# Altium schematic sheet RFFE-Pilot-Ver1.SchDoc
size A2; SheetNumber: 2; SheetTotal: 3
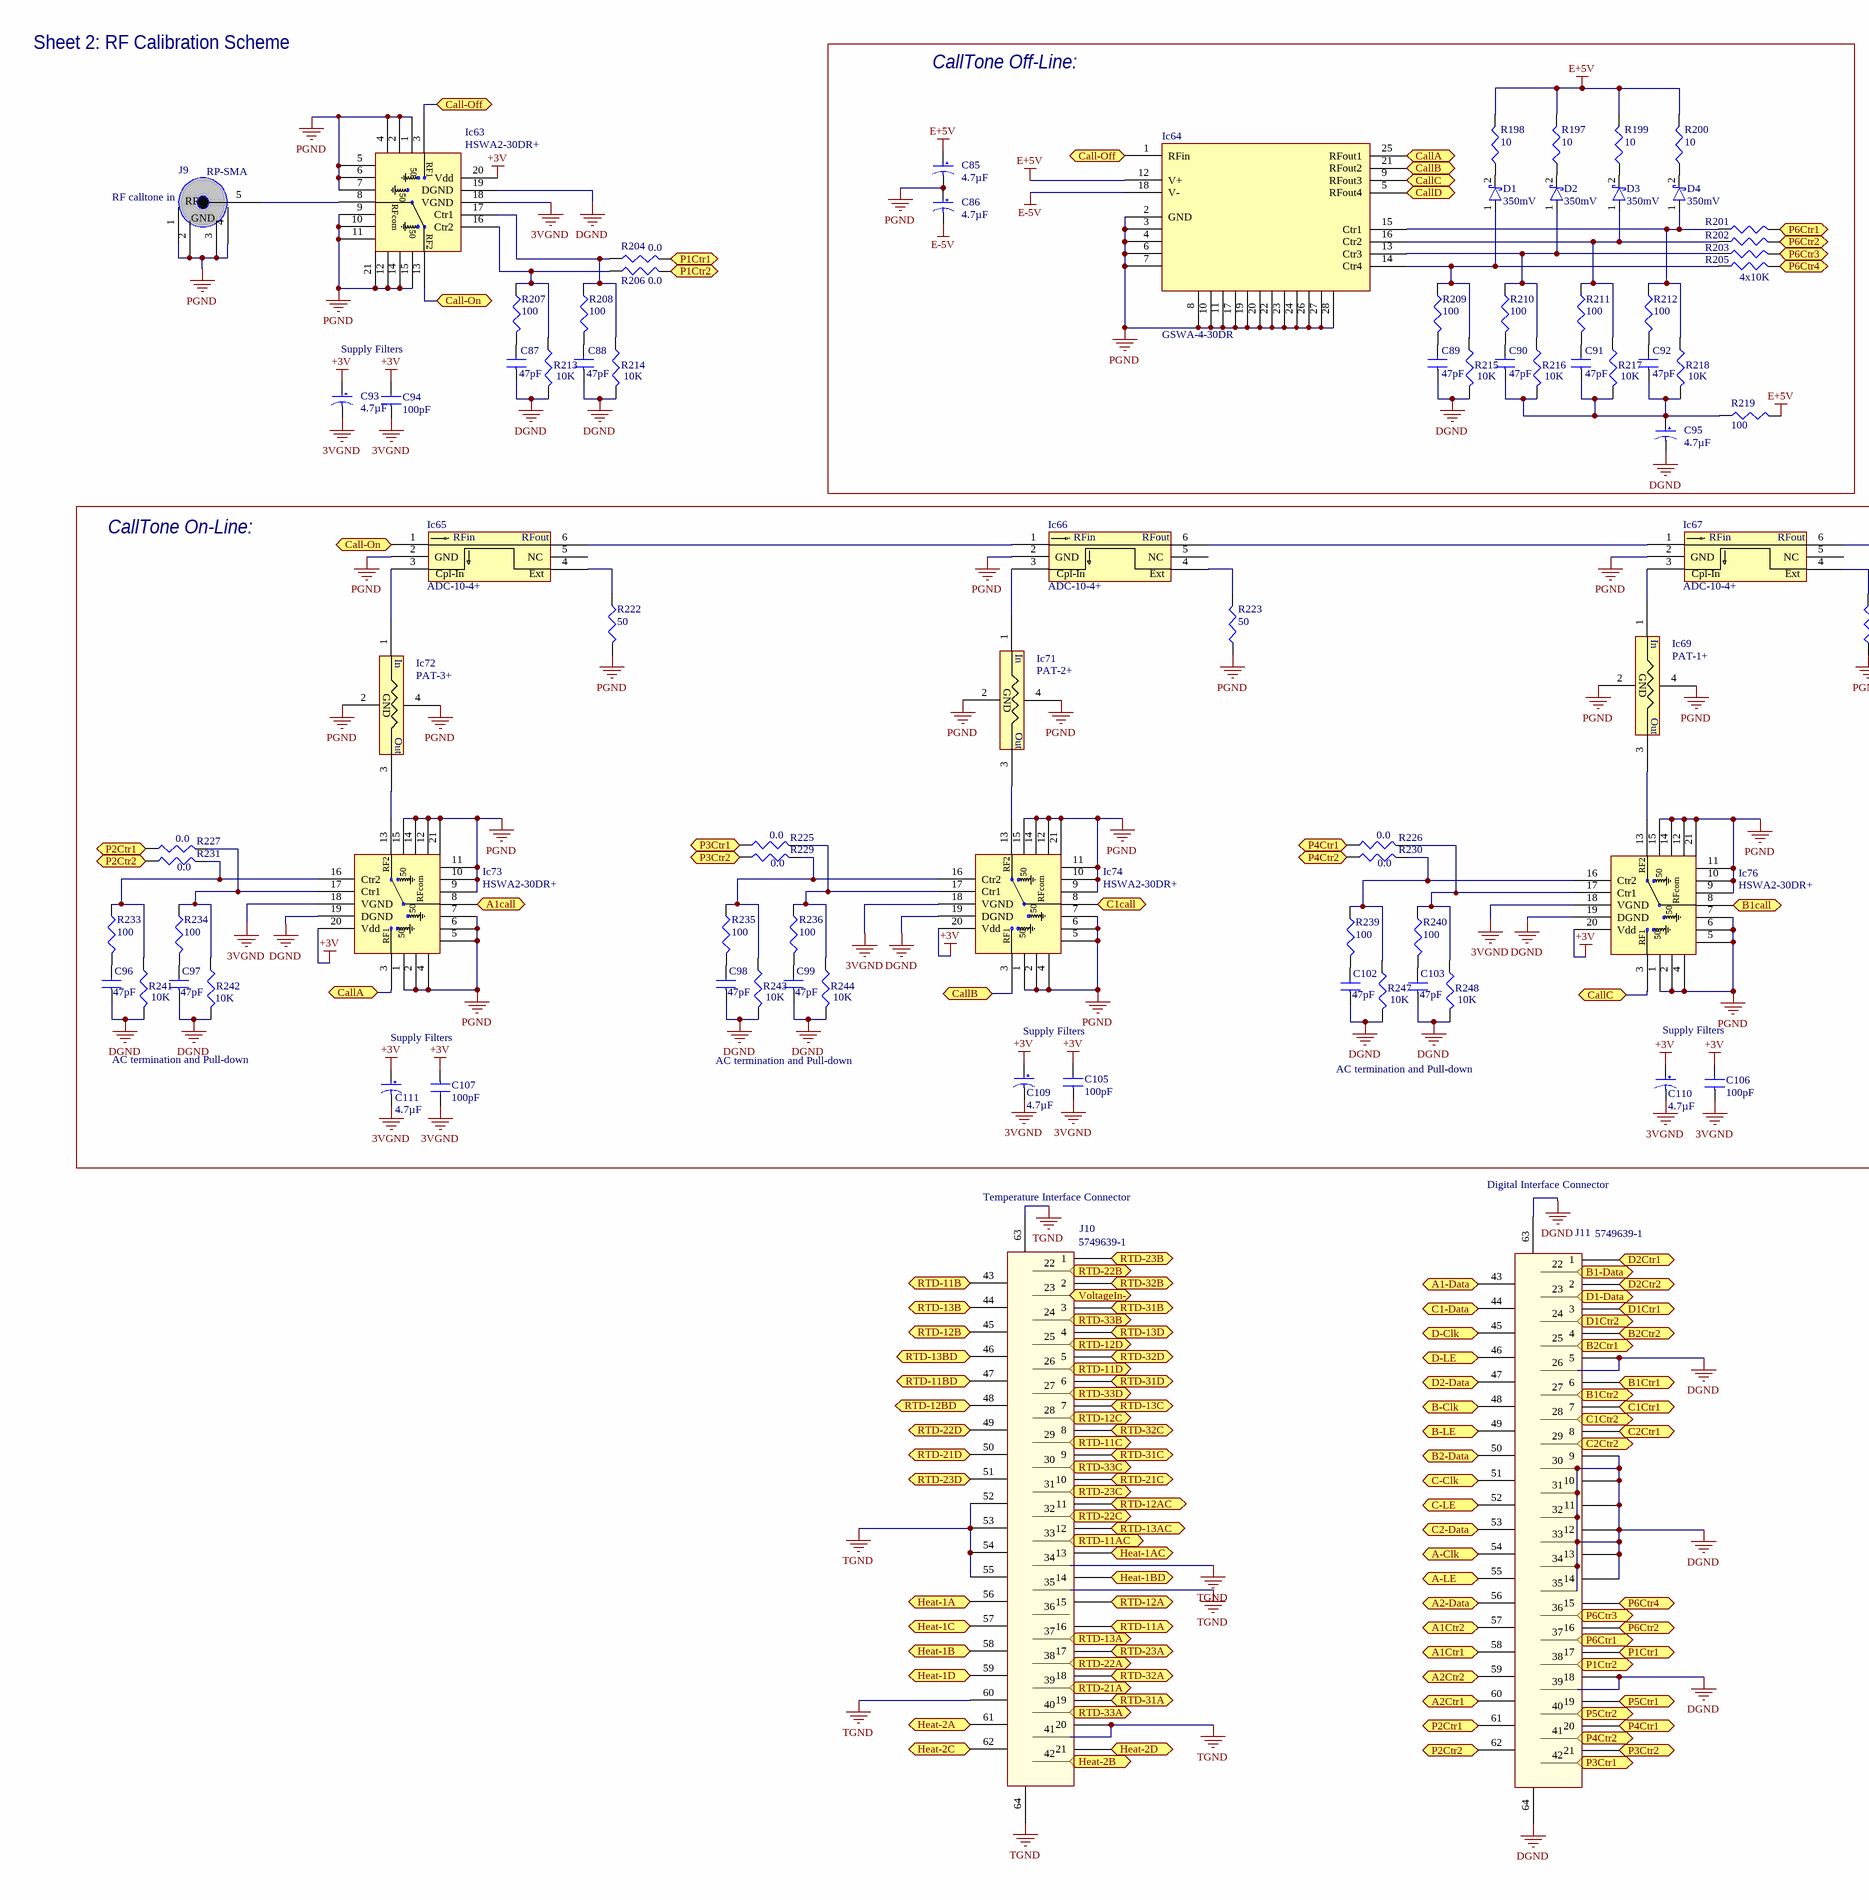
[diagram p0: RFFE-Pilot-Ver1.SchDoc, left]
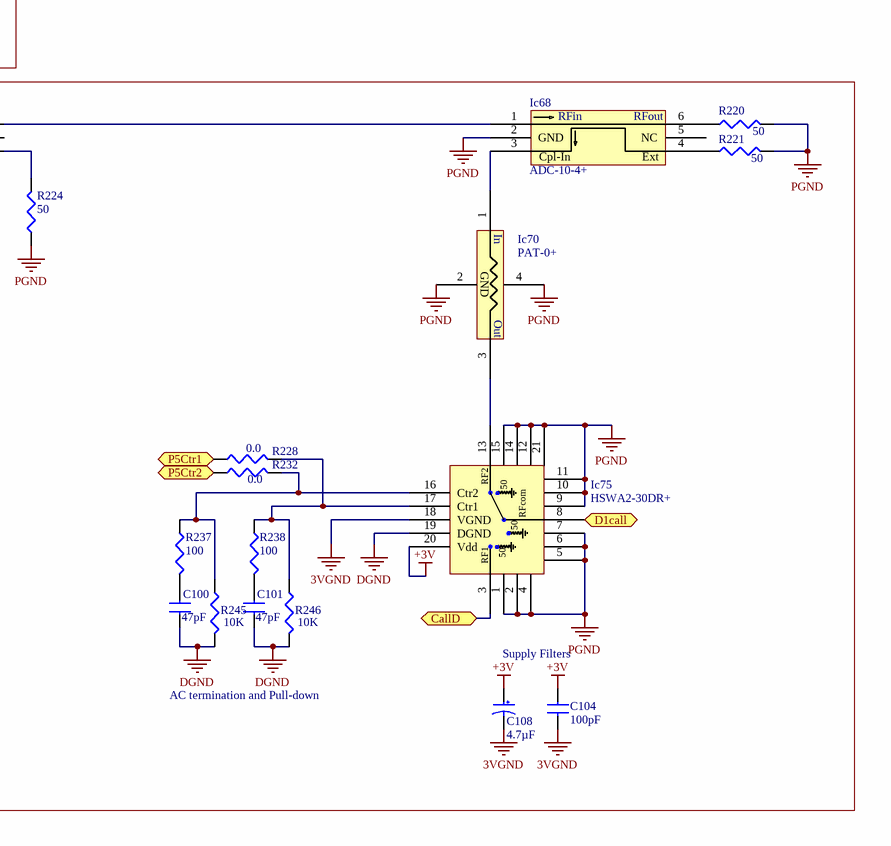
[diagram p1: RFFE-Pilot-Ver1.SchDoc, right]

## Parts
C85  Capacitance: 4.7µF  [TC3528-1411]  (hidden comment: CAP TANT 4.7UF)
C86  Capacitance: 4.7µF  [TC3528-1411]  (hidden comment: CAP TANT 4.7UF)
C87  Capacitance: 47pF  [CAPC1608N]  (hidden comment: C1608C0G1H470J)
C88  Capacitance: 47pF  [CAPC1608N]  (hidden comment: C1608C0G1H470J)
C89  Capacitance: 47pF  [CAPC1608N]  (hidden comment: C1608C0G1H470J)
C90  Capacitance: 47pF  [CAPC1608N]  (hidden comment: C1608C0G1H470J)
C91  Capacitance: 47pF  [CAPC1608N]  (hidden comment: C1608C0G1H470J)
C92  Capacitance: 47pF  [CAPC1608N]  (hidden comment: C1608C0G1H470J)
C93  Capacitance: 4.7µF  [TC3528-1411]  (hidden comment: CAP TANT 4.7UF)
C94  Capacitance: 100pF  [CAPC1608N]  (hidden comment: C1608C0G1H101J)
C95  Capacitance: 4.7µF  [TC3528-1411]  (hidden comment: CAP TANT 4.7UF)
C96  Capacitance: 47pF  [CAPC1608N]  (hidden comment: C1608C0G1H470J)
C97  Capacitance: 47pF  [CAPC1608N]  (hidden comment: C1608C0G1H470J)
C98  Capacitance: 47pF  [CAPC1608N]  (hidden comment: C1608C0G1H470J)
C99  Capacitance: 47pF  [CAPC1608N]  (hidden comment: C1608C0G1H470J)
C100  Capacitance: 47pF  [CAPC1608N]  (hidden comment: C1608C0G1H470J)
C101  Capacitance: 47pF  [CAPC1608N]  (hidden comment: C1608C0G1H470J)
C102  Capacitance: 47pF  [CAPC1608N]  (hidden comment: C1608C0G1H470J)
C103  Capacitance: 47pF  [CAPC1608N]  (hidden comment: C1608C0G1H470J)
C104  Capacitance: 100pF  [CAPC1608N]  (hidden comment: C1608C0G1H101J)
C105  Capacitance: 100pF  [CAPC1608N]  (hidden comment: C1608C0G1H101J)
C106  Capacitance: 100pF  [CAPC1608N]  (hidden comment: C1608C0G1H101J)
C107  Capacitance: 100pF  [CAPC1608N]  (hidden comment: C1608C0G1H101J)
C108  Capacitance: 4.7µF  [TC3528-1411]  (hidden comment: CAP TANT 4.7UF)
C109  Capacitance: 4.7µF  [TC3528-1411]  (hidden comment: CAP TANT 4.7UF)
C110  Capacitance: 4.7µF  [TC3528-1411]  (hidden comment: CAP TANT 4.7UF)
C111  Capacitance: 4.7µF  [TC3528-1411]  (hidden comment: CAP TANT 4.7UF)
D1  Voltage - Forward (Vf) (Max) @ If: 350mV  [RESC1005L]  (hidden comment: RB521CS-30T2R)
D2  Voltage - Forward (Vf) (Max) @ If: 350mV  [RESC1005L]  (hidden comment: RB521CS-30T2R)
D3  Voltage - Forward (Vf) (Max) @ If: 350mV  [RESC1005L]  (hidden comment: RB521CS-30T2R)
D4  Voltage - Forward (Vf) (Max) @ If: 350mV  [RESC1005L]  (hidden comment: RB521CS-30T2R)
Ic63  HSWA2-30DR+  [DG983-1]
Ic64  GSWA-4-30DR  [AN1102]
Ic65  ADC-10-4+  [CD542]
Ic66  ADC-10-4+  [CD542]
Ic67  ADC-10-4+  [CD542]
Ic68  ADC-10-4+  [CD542]
Ic69  PAT-1+  [AF320]
Ic70  PAT-0+  [AF320]
Ic71  PAT-2+  [AF320]
Ic72  PAT-3+  [AF320]
Ic73  HSWA2-30DR+  [DG983-1]
Ic74  HSWA2-30DR+  [DG983-1]
Ic75  HSWA2-30DR+  [DG983-1]
Ic76  HSWA2-30DR+  [DG983-1]
J9  Connector Style: RP-SMA  [SMAedge50R]  (hidden comment: CONN SMA)
J10  CONN D-SUB  [D-SUB62]  (value not drawn)
J11  CONN D-SUB  [D-SUB62]  (value not drawn)
R197  Resistance (Ohms): 10  [RESC1608N]  (hidden comment: ERJ-3GEYJ100V)
R198  Resistance (Ohms): 10  [RESC1608N]  (hidden comment: ERJ-3GEYJ100V)
R199  Resistance (Ohms): 10  [RESC1608N]  (hidden comment: ERJ-3GEYJ100V)
R200  Resistance (Ohms): 10  [RESC1608N]  (hidden comment: ERJ-3GEYJ100V)
R201  ERJ-3GEYJ103V  [RESC1608N]  (value not drawn)
R202  ERJ-3GEYJ103V  [RESC1608N]  (value not drawn)
R203  ERJ-3GEYJ103V  [RESC1608N]  (value not drawn)
R204  Resistance (Ohms): 0.0  [CAPC1608N]  (hidden comment: ERJ-3GEY0R00V)
R205  Resistance (Ohms): 10K  [RESC1608N]  (hidden comment: ERJ-3GEYJ103V)
R206  Resistance (Ohms): 0.0  [CAPC1608N]  (hidden comment: ERJ-3GEY0R00V)
R207  Resistance (Ohms): 100  [RESC1608N]  (hidden comment: ERJ-3GEYJ101V)
R208  Resistance (Ohms): 100  [RESC1608N]  (hidden comment: ERJ-3GEYJ101V)
R209  Resistance (Ohms): 100  [RESC1608N]  (hidden comment: ERJ-3GEYJ101V)
R210  Resistance (Ohms): 100  [RESC1608N]  (hidden comment: ERJ-3GEYJ101V)
R211  Resistance (Ohms): 100  [RESC1608N]  (hidden comment: ERJ-3GEYJ101V)
R212  Resistance (Ohms): 100  [RESC1608N]  (hidden comment: ERJ-3GEYJ101V)
R213  Resistance (Ohms): 10K  [RESC1608N]  (hidden comment: ERJ-3GEYJ103V)
R214  Resistance (Ohms): 10K  [RESC1608N]  (hidden comment: ERJ-3GEYJ103V)
R215  Resistance (Ohms): 10K  [RESC1608N]  (hidden comment: ERJ-3GEYJ103V)
R216  Resistance (Ohms): 10K  [RESC1608N]  (hidden comment: ERJ-3GEYJ103V)
R217  Resistance (Ohms): 10K  [RESC1608N]  (hidden comment: ERJ-3GEYJ103V)
R218  Resistance (Ohms): 10K  [RESC1608N]  (hidden comment: ERJ-3GEYJ103V)
R219  Resistance (Ohms): 100  [RESC1608N]  (hidden comment: ERJ-3GEYJ101V)
R220  Resistance (Ohms): 50  [RESC3216M]  (hidden comment: RES 50 OHM)
R221  Resistance (Ohms): 50  [RESC3216M]  (hidden comment: RES 50 OHM)
R222  Resistance (Ohms): 50  [RESC3216M]  (hidden comment: RES 50 OHM)
R223  Resistance (Ohms): 50  [RESC3216M]  (hidden comment: RES 50 OHM)
R224  Resistance (Ohms): 50  [RESC3216M]  (hidden comment: RES 50 OHM)
R225  Resistance (Ohms): 0.0  [RESC1608M]  (hidden comment: RES 0.0 OHM)
R226  Resistance (Ohms): 0.0  [RESC1608M]  (hidden comment: RES 0.0 OHM)
R227  Resistance (Ohms): 0.0  [RESC1608M]  (hidden comment: RES 0.0 OHM)
R228  Resistance (Ohms): 0.0  [RESC1608M]  (hidden comment: RES 0.0 OHM)
R229  Resistance (Ohms): 0.0  [RESC1608M]  (hidden comment: RES 0.0 OHM)
R230  Resistance (Ohms): 0.0  [RESC1608M]  (hidden comment: RES 0.0 OHM)
R231  Resistance (Ohms): 0.0  [RESC1608M]  (hidden comment: RES 0.0 OHM)
R232  Resistance (Ohms): 0.0  [RESC1608M]  (hidden comment: RES 0.0 OHM)
R233  Resistance (Ohms): 100  [RESC1608N]  (hidden comment: ERJ-3GEYJ101V)
R234  Resistance (Ohms): 100  [RESC1608N]  (hidden comment: ERJ-3GEYJ101V)
R235  Resistance (Ohms): 100  [RESC1608N]  (hidden comment: ERJ-3GEYJ101V)
R236  Resistance (Ohms): 100  [RESC1608N]  (hidden comment: ERJ-3GEYJ101V)
R237  Resistance (Ohms): 100  [RESC1608N]  (hidden comment: ERJ-3GEYJ101V)
R238  Resistance (Ohms): 100  [RESC1608N]  (hidden comment: ERJ-3GEYJ101V)
R239  Resistance (Ohms): 100  [RESC1608N]  (hidden comment: ERJ-3GEYJ101V)
R240  Resistance (Ohms): 100  [RESC1608N]  (hidden comment: ERJ-3GEYJ101V)
R241  Resistance (Ohms): 10K  [RESC1608N]  (hidden comment: ERJ-3GEYJ103V)
R242  Resistance (Ohms): 10K  [RESC1608N]  (hidden comment: ERJ-3GEYJ103V)
R243  Resistance (Ohms): 10K  [RESC1608N]  (hidden comment: ERJ-3GEYJ103V)
R244  Resistance (Ohms): 10K  [RESC1608N]  (hidden comment: ERJ-3GEYJ103V)
R245  Resistance (Ohms): 10K  [RESC1608N]  (hidden comment: ERJ-3GEYJ103V)
R246  Resistance (Ohms): 10K  [RESC1608N]  (hidden comment: ERJ-3GEYJ103V)
R247  Resistance (Ohms): 10K  [RESC1608N]  (hidden comment: ERJ-3GEYJ103V)
R248  Resistance (Ohms): 10K  [RESC1608N]  (hidden comment: ERJ-3GEYJ103V)

## Blocks framed on the sheet
CallTone Off-Line:: C85 C86 C89-C92 C95 D1-D4 Ic64 R197-R203 R205 R209-R212 R215-R219
CallTone On-Line:: C96-C111 Ic65-Ic76 R220-R248

## Ports
A1-Data, A1call, A1Ctr1, A1Ctr2, A2-Data, A2Ctr1, A2Ctr2, A-Clk, A-LE, B1-Data, B1call, B1Ctr1, B1Ctr2, B2-Data, B2Ctr1, B2Ctr2, B-Clk, B-LE, C1-Data, C1call, C1Ctr1, C1Ctr2, C2-Data, C2Ctr1, C2Ctr2, C-Clk, C-LE, Call-Off, Call-On, CallA, CallB, CallC, CallD, D1-Data, D1call, D1Ctr1, D1Ctr2, D2-Data, D2Ctr1, D2Ctr2, D-Clk, D-LE, Heat-1A, Heat-1AC, Heat-1B, Heat-1BD, Heat-1C, Heat-1D, Heat-2A, Heat-2B, Heat-2C, Heat-2D, P1Ctr1, P1Ctr2, P2Ctr1, P2Ctr2, P3Ctr1, P3Ctr2, P4Ctr1, P4Ctr2, P5Ctr1, P5Ctr2, P6Ctr1, P6Ctr2, P6Ctr3, P6Ctr4, RTD-11A, RTD-11AC, RTD-11B, RTD-11BD, RTD-11C, RTD-11D, RTD-12A, RTD-12AC, RTD-12B, RTD-12BD, RTD-12C, RTD-12D, RTD-13A, RTD-13AC, RTD-13B, RTD-13BD, RTD-13C, RTD-13D, RTD-21A, RTD-21C, RTD-21D, RTD-22A, RTD-22B, RTD-22C, RTD-22D, RTD-23A, RTD-23B, RTD-23C, RTD-23D, RTD-31A, RTD-31B, RTD-31C, RTD-31D, RTD-32A, RTD-32B, RTD-32C, RTD-32D, RTD-33A, RTD-33B, RTD-33C, RTD-33D, VoltageIn-

## Nets
3VGND: C93.2 C94.2 C104.2 C105.2 C106.2 C107.1 C108.2 C109.2 C110.2 C111.2 Ic63.18(VGND) Ic73.18(VGND) Ic74.18(VGND) Ic75.18(VGND) Ic76.18(VGND)
+3V: C93.1 C94.1 C104.1 C105.1 C106.1 C107.2 C108.1 C109.1 C110.1 C111.1 Ic63.20(Vdd) Ic73.20(Vdd) Ic74.20(Vdd) Ic75.20(Vdd) Ic76.20(Vdd)
DGND: C87.2 C88.2 C89.2 C95.2 C96.2 C97.2 C98.2 C99.2 C100.2 C101.2 C102.2 C103.2 Ic63.19(DGND) Ic73.19(DGND) Ic74.19(DGND) Ic75.19(DGND) Ic76.19(DGND) J11.5 J11.9 J11.10 J11.11 J11.12 J11.13 J11.14 J11.18 J11.26 J11.30 J11.31 J11.32 J11.33 J11.34 J11.35 J11.39 J11.63 J11.64 R213.1 R214.1 R215.1 R241.1 R242.1 R243.1 R244.1 R245.1 R246.1 R247.1 R248.1
E+5V: C85.1 Ic64.12(V+) R197.1 R198.1 R199.1 R200.1 R219.1
E-5V: C86.2 Ic64.18(V-)
PGND: C85.2 C86.1 Ic63.1(GND) Ic63.2(GND) Ic63.4(GND) Ic63.5(GND) Ic63.6(GND) Ic63.7(GND) Ic63.9(GND) Ic63.10(GND) Ic63.11(GND) Ic63.12(GND) Ic63.14(GND) Ic63.15(GND) Ic63.21(GND) Ic64.2(GND) Ic64.3(GND) Ic64.4(GND) Ic64.6(GND) Ic64.7(GND) Ic64.8(GND) Ic64.10(GND) Ic64.11(GND) Ic64.17(GND) Ic64.19(GND) Ic64.20(GND) Ic64.22(GND) Ic64.23(GND) Ic64.24(GND) Ic64.26(GND) Ic64.27(GND) Ic64.28(GND) Ic65.2(GND) Ic66.2(GND) Ic67.2(GND) Ic68.2(GND) Ic69.2(GND) Ic69.4(GND) Ic70.2(GND) Ic70.4(GND) Ic71.2(GND) Ic71.4(GND) Ic72.2(GND) Ic72.4(GND) Ic73.1(GND) Ic73.2(GND) Ic73.4(GND) Ic73.5(GND) Ic73.6(GND) Ic73.7(GND) Ic73.9(GND) Ic73.10(GND) Ic73.11(GND) Ic73.12(GND) Ic73.14(GND) Ic73.15(GND) Ic73.21(GND) Ic74.1(GND) Ic74.2(GND) Ic74.4(GND) Ic74.5(GND) Ic74.6(GND) Ic74.7(GND) Ic74.9(GND) Ic74.10(GND) Ic74.11(GND) Ic74.12(GND) Ic74.14(GND) Ic74.15(GND) Ic74.21(GND) Ic75.1(GND) Ic75.2(GND) Ic75.4(GND) Ic75.5(GND) Ic75.6(GND) Ic75.7(GND) Ic75.9(GND) Ic75.10(GND) Ic75.11(GND) Ic75.12(GND) Ic75.14(GND) Ic75.15(GND) Ic75.21(GND) Ic76.1(GND) Ic76.2(GND) Ic76.4(GND) Ic76.5(GND) Ic76.6(GND) Ic76.7(GND) Ic76.9(GND) Ic76.10(GND) Ic76.11(GND) Ic76.12(GND) Ic76.14(GND) Ic76.15(GND) Ic76.21(GND) J9.1(GND) J9.2(GND) J9.3(GND) J9.4(GND) R220.1 R221.1 R222.1 R223.2 R224.2
TGND: J10.20 J10.34 J10.35 J10.41 J10.52 J10.53 J10.54 J10.55 J10.60 J10.63 J10.64
A1-Data: J11.43 ; port A1-Data
A1call: Ic73.8(RFcom) ; port A1call
A1Ctr1: J11.58 ; port A1Ctr1
A1Ctr2: J11.57 ; port A1Ctr2
A2-Data: J11.56 ; port A2-Data
A2Ctr1: J11.60 ; port A2Ctr1
A2Ctr2: J11.59 ; port A2Ctr2
A-Clk: J11.54 ; port A-Clk
A-LE: J11.55 ; port A-LE
B1-Data: J11.22 ; port B1-Data
B1call: Ic76.8(RFcom) ; port B1call
B1Ctr1: J11.6 ; port B1Ctr1
B1Ctr2: J11.27 ; port B1Ctr2
B2-Data: J11.50 ; port B2-Data
B2Ctr1: J11.25 ; port B2Ctr1
B2Ctr2: J11.4 ; port B2Ctr2
B-Clk: J11.48 ; port B-Clk
B-LE: J11.49 ; port B-LE
C1-Data: J11.44 ; port C1-Data
C1call: Ic74.8(RFcom) ; port C1call
C1Ctr1: J11.7 ; port C1Ctr1
C1Ctr2: J11.28 ; port C1Ctr2
C2-Data: J11.53 ; port C2-Data
C2Ctr1: J11.8 ; port C2Ctr1
C2Ctr2: J11.29 ; port C2Ctr2
C-Clk: J11.51 ; port C-Clk
C-LE: J11.52 ; port C-LE
Call-Off: Ic63.3(RF1) Ic64.1(RFin) ; port Call-Off
Call-On: Ic63.13(RF2) Ic65.1(In) ; port Call-On
CallA: Ic64.25(RFout1) Ic73.3(RF1) ; port CallA
CallB: Ic64.21(RFout2) Ic74.3(RF1) ; port CallB
CallC: Ic64.9(RFout3) Ic76.3(RF1) ; port CallC
CallD: Ic64.5(RFout4) Ic75.3(RF1) ; port CallD
D1-Data: J11.23 ; port D1-Data
D1call: Ic75.8(RFcom) ; port D1call
D1Ctr1: J11.3 ; port D1Ctr1
D1Ctr2: J11.24 ; port D1Ctr2
D2-Data: J11.47 ; port D2-Data
D2Ctr1: J11.1 ; port D2Ctr1
D2Ctr2: J11.2 ; port D2Ctr2
D-Clk: J11.45 ; port D-Clk
D-LE: J11.46 ; port D-LE
Heat-1A: J10.56 ; port Heat-1A
Heat-1AC: J10.13 ; port Heat-1AC
Heat-1B: J10.58 ; port Heat-1B
Heat-1BD: J10.14 ; port Heat-1BD
Heat-1C: J10.57 ; port Heat-1C
Heat-1D: J10.59 ; port Heat-1D
Heat-2A: J10.61 ; port Heat-2A
Heat-2B: J10.42 ; port Heat-2B
Heat-2C: J10.62 ; port Heat-2C
Heat-2D: J10.21 ; port Heat-2D
P1Ctr1: J11.17 R204.1 ; port P1Ctr1
P1Ctr2: J11.38 R206.1 ; port P1Ctr2
P2Ctr1: J11.61 R227.2 ; port P2Ctr1
P2Ctr2: J11.62 R231.2 ; port P2Ctr2
P3Ctr1: J11.42 R225.2 ; port P3Ctr1
P3Ctr2: J11.21 R229.2 ; port P3Ctr2
P4Ctr1: J11.20 R226.2 ; port P4Ctr1
P4Ctr2: J11.41 R230.2 ; port P4Ctr2
P5Ctr1: J11.19 R228.2 ; port P5Ctr1
P5Ctr2: J11.40 R232.2 ; port P5Ctr2
P6Ctr1: J11.37 R201.1 ; port P6Ctr1
P6Ctr2: J11.16 R202.1 ; port P6Ctr2
P6Ctr3: J11.36 R203.1 ; port P6Ctr3
P6Ctr4: J11.15 R205.1 ; port P6Ctr4
RTD-11A: J10.16 ; port RTD-11A
RTD-11AC: J10.33 ; port RTD-11AC
RTD-11B: J10.43 ; port RTD-11B
RTD-11BD: J10.47 ; port RTD-11BD
RTD-11C: J10.29 ; port RTD-11C
RTD-11D: J10.26 ; port RTD-11D
RTD-12A: J10.15 ; port RTD-12A
RTD-12AC: J10.11 ; port RTD-12AC
RTD-12B: J10.45 ; port RTD-12B
RTD-12BD: J10.48 ; port RTD-12BD
RTD-12C: J10.28 ; port RTD-12C
RTD-12D: J10.25 ; port RTD-12D
RTD-13A: J10.37 ; port RTD-13A
RTD-13AC: J10.12 ; port RTD-13AC
RTD-13B: J10.44 ; port RTD-13B
RTD-13BD: J10.46 ; port RTD-13BD
RTD-13C: J10.7 ; port RTD-13C
RTD-13D: J10.4 ; port RTD-13D
RTD-21A: J10.39 ; port RTD-21A
RTD-21C: J10.10 ; port RTD-21C
RTD-21D: J10.50 ; port RTD-21D
RTD-22A: J10.38 ; port RTD-22A
RTD-22B: J10.22 ; port RTD-22B
RTD-22C: J10.32 ; port RTD-22C
RTD-22D: J10.49 ; port RTD-22D
RTD-23A: J10.17 ; port RTD-23A
RTD-23B: J10.1 ; port RTD-23B
RTD-23C: J10.31 ; port RTD-23C
RTD-23D: J10.51 ; port RTD-23D
RTD-31A: J10.19 ; port RTD-31A
RTD-31B: J10.3 ; port RTD-31B
RTD-31C: J10.9 ; port RTD-31C
RTD-31D: J10.6 ; port RTD-31D
RTD-32A: J10.18 ; port RTD-32A
RTD-32B: J10.2 ; port RTD-32B
RTD-32C: J10.8 ; port RTD-32C
RTD-32D: J10.5 ; port RTD-32D
RTD-33A: J10.40 ; port RTD-33A
RTD-33B: J10.24 ; port RTD-33B
RTD-33C: J10.30 ; port RTD-33C
RTD-33D: J10.27 ; port RTD-33D
VoltageIn-: J10.23 ; port VoltageIn-
NetC87_1: C87.1 R207.1
NetC88_1: C88.1 R208.1
NetC89_1: C89.1 R209.1
NetC90_1: C90.1 R210.1
NetC90_2: C90.2 C91.2 C92.2 C95.1 R216.1 R217.1 R218.1 R219.2
NetC91_1: C91.1 R211.1
NetC92_1: C92.1 R212.1
NetC96_1: C96.1 R233.1
NetC97_1: C97.1 R234.1
NetC98_1: C98.1 R235.1
NetC99_1: C99.1 R236.1
NetC100_1: C100.1 R237.1
NetC101_1: C101.1 R238.1
NetC102_1: C102.1 R239.1
NetC103_1: C103.1 R240.1
NetD1_1: D1.1 Ic64.14(Ctr4) R205.2 R209.2 R215.2
NetD1_2: D1.2 R198.2
NetD2_1: D2.1 Ic64.13(Ctr3) R203.2 R210.2 R216.2
NetD2_2: D2.2 R197.2
NetD3_1: D3.1 Ic64.16(Ctr2) R202.2 R211.2 R217.2
NetD3_2: D3.2 R199.2
NetD4_1: D4.1 Ic64.15(Ctr1) R201.2 R212.2 R218.2
NetD4_2: D4.2 R200.2
NetIc63_8: Ic63.8(RFcom) J9.5(RFin)
NetIc63_16: Ic63.16(Ctr2) R206.2 R207.2 R213.2
NetIc63_17: Ic63.17(Ctr1) R204.2 R208.2 R214.2
NetIc65_3: Ic65.3(Cpl-In) Ic72.1(In)
NetIc65_4: Ic65.4(Ext) R222.2
NetIc65_6: Ic65.6(Out) Ic66.1(In)
NetIc66_3: Ic66.3(Cpl-In) Ic71.1(In)
NetIc66_4: Ic66.4(Ext) R223.1
NetIc66_6: Ic66.6(Out) Ic67.1(In)
NetIc67_3: Ic67.3(Cpl-In) Ic69.1(In)
NetIc67_4: Ic67.4(Ext) R224.1
NetIc67_6: Ic67.6(Out) Ic68.1(In)
NetIc68_3: Ic68.3(Cpl-In) Ic70.1(In)
NetIc68_4: Ic68.4(Ext) R221.2
NetIc68_6: Ic68.6(Out) R220.2
NetIc69_3: Ic69.3(Out) Ic76.13(RF2)
NetIc70_3: Ic70.3(Out) Ic75.13(RF2)
NetIc71_3: Ic71.3(Out) Ic74.13(RF2)
NetIc72_3: Ic72.3(Out) Ic73.13(RF2)
NetIc73_16: Ic73.16(Ctr2) R231.1 R233.2 R241.2
NetIc73_17: Ic73.17(Ctr1) R227.1 R234.2 R242.2
NetIc74_16: Ic74.16(Ctr2) R229.1 R235.2 R243.2
NetIc74_17: Ic74.17(Ctr1) R225.1 R236.2 R244.2
NetIc75_16: Ic75.16(Ctr2) R232.1 R237.2 R245.2
NetIc75_17: Ic75.17(Ctr1) R228.1 R238.2 R246.2
NetIc76_16: Ic76.16(Ctr2) R230.1 R239.2 R247.2
NetIc76_17: Ic76.17(Ctr1) R226.1 R240.2 R248.2

Not connected (* = marked no-connect by the designer): Ic65 5(NC); Ic66 5(NC); Ic67 5(NC); Ic68 5(NC); J10 36

## Notes on the sheet
- Sheet 2: RF Calibration Scheme
- (near J9) RF calltone in
- (near R205) 4x
- Supply Filters
- AC termination and Pull-down
- (near J10) Temperature Interface Connector
- Digital Interface Connector
- (in symbol 132289RP) RF
- (in symbol Minicircuits-ADC-10-4) RFin; RFout
- (in symbol Minicircuits-HSWA2-30DR+) 50

## Library data of the parts
C85 C86 C93 C95 C108-C111 = T495B475K016ZTE800: CAP TANT 4.7UF 16V 10% 1411; Manufacturer: Kemet; Manufacturer Size Code: B; ESR (Equivalent Series Resistance): 800.0 mOhm; Type: Molded; Supplier 1: Digi-Key; Manufacturer Part Number: T495B475K016ZTE800; RoHS: RoHS Compliant; Category: Capacitors; Stock 1: 4639; Pricing 1: 1=2.2, 10=1.804, 25=1.628, 100=1.452, 250=1.276, 500=1.188, 1000=0.924 (USD); Voltage - Rated: 16V; Tolerance: ±10%; Operating Temperature: -55°C ~ 125°C; Mounting Type: Surface Mount; Package / Case: 1411 (3528 Metric); Size / Dimension: 0.138" L x 0.110" W (3.50mm x 2.80mm); Height - Seated (Max): 0.083" (2.10mm); Lead Spacing: -; Features: General Purpose; Packaging: Cut Tape (CT); Lifetime @ Temp.: -; ComponentLink1URL: http://www.kemet.com/datasheets&T495B475K016ZTE800; ComponentLink1Description: http://www.kemet.com/datasheets&T495B475K016ZTE800; Supplier Part Number 1: 399-5191-1-ND
C87-C92 C96-C103 = C1608C0G1H470J: CAP CER 47PF 50V 5% NP0 0603; Manufacturer: TDK Corporation; Temperature Coefficient: C0G, NP0; Supplier 1: Digi-Key; Manufacturer Part Number: C1608C0G1H470J; RoHS: RoHS Compliant; Category: Capacitors; Stock 1: 109430; Pricing 1: 1=0.1, 10=0.063, 100=0.0225, 250=0.01624, 500=0.012, 1000=0.00813 (USD); Voltage - Rated: 50V; Tolerance: ±5%; Mounting Type: Surface Mount, MLCC; Operating Temperature: -55°C ~ 125°C; Applications: General Purpose; Ratings: -; Package / Case: 0603 (1608 Metric); Size / Dimension: 0.063" L x 0.031" W (1.60mm x 0.80mm); Height - Seated (Max): -; Thickness (Max): 0.037" (0.95mm); Lead Spacing: -; Features: -; Packaging: Cut Tape (CT); Lead Style: -; ComponentLink1URL: http://www.tdk.com/pdf/general_B11.pdf; ComponentLink1Description: http://www.tdk.com/pdf/general_B11.pdf; Supplier Part Number 1: 445-1277-1-ND
C94 C104-C107 = C1608C0G1H101J: CAP CER 100PF 50V 5% NP0 0603; Manufacturer: TDK Corporation; Temperature Coefficient: C0G, NP0; Supplier 1: Digi-Key; Manufacturer Part Number: C1608C0G1H101J; RoHS: RoHS Compliant; Category: Capacitors; Stock 1: 926382; Pricing 1: 1=0.09, 10=0.055, 100=0.0198, 250=0.01432, 500=0.01056, 1000=0.00715 (USD); Voltage - Rated: 50V; Tolerance: ±5%; Mounting Type: Surface Mount, MLCC; Operating Temperature: -55°C ~ 125°C; Applications: General Purpose; Ratings: -; Package / Case: 0603 (1608 Metric); Size / Dimension: 0.063" L x 0.031" W (1.60mm x 0.80mm); Height - Seated (Max): -; Thickness (Max): 0.037" (0.95mm); Lead Spacing: -; Features: -; Packaging: Cut Tape (CT); Lead Style: -; ComponentLink1URL: http://www.tdk.com/pdf/general_B11.pdf; ComponentLink1Description: http://www.tdk.com/pdf/general_B11.pdf; Supplier Part Number 1: 445-1281-1-ND
D1-D4 = RB521CS-30T2R: DIODE SCHOTTKY SS 30V 100MA 2VMN; Manufacturer: Rohm Semiconductor; Speed: Small Signal =< 200mA (Io), Any Speed; Current - Reverse Leakage @ Vr: 10µA @ 10V; Supplier 1: Digi-Key; Manufacturer Part Number: RB521CS-30T2R; RoHS: RoHS Compliant; Category: Discrete Semiconductor Products; Stock 1: 0; Diode Type: Schottky; Voltage - DC Reverse (Vr) (Max): 30V; Current - Average Rectified (Io): 100mA; Reverse Recovery Time (trr): -; Capacitance @ Vr, F: -; Mounting Type: Surface Mount; Package / Case: 2-SMD, Flat Lead; Supplier Device Package: VMN2; Packaging: Cut Tape (CT); ComponentLink1URL: http://www.rohm.com/products/databook/di/pdf/rb521cs-30.pdf; ComponentLink1Description: http://www.rohm.com/products/databook/di/pdf/rb521cs-30.pdf; Supplier Part Number 1: RB521CS-30T2RCT-ND
Ic63 Ic73-Ic76 = Minicircuits-HSWA2-30DR+: Absoptive RF Switch SPDT; Manufacturer: Minicircuits; Manufacturer Part Number: HSWA2-30DR+; ComponentLink1Description: http://www.minicircuits.com/pdfs/HSWA2-30DR+.pdf; ComponentLink1URL: http://www.minicircuits.com/pdfs/HSWA2-30DR+.pdf
Ic64 = Minicircuits-GSWA-4-30DR: SP4T Absorptive GaAs Switch; Manufacturer Part Number: GSWA-4-30DR; Manufacturer: Minicircuits; ComponentLink1Description: http://www.minicircuits.com/pdfs/GSWA-4-30DR.pdf; ComponentLink1URL: http://www.minicircuits.com/pdfs/GSWA-4-30DR.pdf
Ic65-Ic68 = Minicircuits-ADC-10-4: Coupler 10 dB; Manufacturer Part Number: ADC-10-4+; Manufacturer: Minicircuits; Comment_1: Coupler 10 dB; ComponentLink1Description: http://www.minicircuits.com/pdfs/ADC-10-4.pdf; ComponentLink1URL: http://www.minicircuits.com/pdfs/ADC-10-4.pdf
Ic69 = Minicircuits-PAT-1+: Fixed Attenuator 1 dB; Manufacturer: Minicircuits; Manufacturer Part Number: PAT-1+; ComponentLink1Description: http://www.minicircuits.com/pdfs/PAT-1+.pdf; ComponentLink1URL: http://www.minicircuits.com/pdfs/PAT-1+.pdf
Ic70 = Minicircuits-PAT-0+: Fixed Attenuator 0 dB; Manufacturer: Minicircuits; Manufacturer Part Number: PAT-0+; ComponentLink1Description: http://www.minicircuits.com/pdfs/PAT-0+.pdf; ComponentLink1URL: http://www.minicircuits.com/pdfs/PAT-0+.pdf
Ic71 = Minicircuits-PAT-2+: Fixed Attenuator 2 dB; Manufacturer: Minicircuits; Manufacturer Part Number: PAT-2+; ComponentLink1Description: http://www.minicircuits.com/pdfs/PAT-2+.pdf; ComponentLink1URL: http://www.minicircuits.com/pdfs/PAT-2+.pdf
Ic72 = Minicircuits-PAT-3+: Fixed Attenuator 3 dB; Manufacturer: Minicircuits; Manufacturer Part Number: PAT-3+; ComponentLink1Description: http://www.minicircuits.com/pdfs/PAT-3+.pdf; ComponentLink1URL: http://www.minicircuits.com/pdfs/PAT-3+.pdf
J9 = 132289RP: CONN RCPT BLKHD SMA REV POL PCB; Manufacturer: Amphenol Connex; Connector Type: Jack, Male Pins; Contact Termination: Solder; Impedance: 50 Ohm; Frequency - Max: 18GHz; Supplier 1: Digi-Key; Manufacturer Part Number: 132289RP; RoHS: RoHS Compliant; Category: Connectors, Interconnects; Stock 1: 65; Pricing 1: 1=10.8, 10=9.99, 100=8.37, 250=7.29, 500=7.02, 1000=6.75 (USD); Mounting Type: Board Edge, End Launch; Fastening Type: Threaded; Cable Group: -; Features: -; Color: -; Packaging: Bulk; ComponentLink1URL: http://www.amphenolconnex.com/media/downloads/4145/132289rp.pdf; ComponentLink1Description: http://www.amphenolconnex.com/media/downloads/4145/132289rp.pdf; Supplier Part Number 1: ACX1427-ND
J10 J11 = 5749639-1: CONN D-SUB PLUG R/A 62POS 30GOLD; Manufacturer: TE Connectivity; Connector Style: D-Sub, High Density; Number of Positions: 62; Connector Type: Plug, Male Pins; Flange Feature: Housing/Shell (4-40); Voltage Rating: 125V; Current Rating: 2A; Supplier 1: Digi-Key; RoHS: RoHS Compliant; Category: Connectors, Interconnects; Stock 1: 0; Pricing 1: 1=15.49, 10=14.08, 25=13.728, 50=12.672, 100=11.968, 250=10.912, 500=10.208, 1000=9.3632, 2500=9.152 (USD); Number of Rows: 3; Shell Size, Connector Layout: 4 (DC, C) High Density; Contact Type: Signal; Mounting Type: Through Hole, Right Angle; Termination: Solder; Features: Board Lock, Grounding Indents; Shell Material, Finish: Steel, Nickel Plated; Contact Finish: Gold; Contact Finish Thickness: 30µin (0.76µm); Ingress Protection: -; Operating Temperature: -55°C ~ 105°C; Housing Material: Polybutylene Terephthalate (PBT), Glass Filled; Color: Black; ComponentLink1URL: http://documents.tycoelectronics.com/commerce/DocumentDelivery/DDEController?Action=srchrtrv&DocNm=5749639&DocType=CD&DocLang=EN; ComponentLink1Description: http://documents.tycoelectronics.com/commerce/DocumentDelivery/DDEController?Action=srchrtrv&DocNm=5749639&DocType=CD&DocLang=EN; Supplier Part Number 1: A31926-ND; Manufacturer Part Number: 5749639-1
R197-R200 = ERJ-3GEYJ100V: RES 10 OHM 1/10W 5% 0603 SMD; Manufacturer: Panasonic - ECG; Power (Watts): 0.1W, 1/10W; Temperature Coefficient: ±200ppm/°C; Supplier 1: Digi-Key; Manufacturer Part Number: ERJ-3GEYJ100V; RoHS: RoHS Compliant; Category: Resistors; Stock 1: 1498816; Pricing 1: 1=0.02, 50=0.0092, 100=0.007, 250=0.0052, 500=0.00384, 1000=0.00256 (USD); Composition: Thick Film; Features: -; Tolerance: ±5%; Package / Case: 0603 (1608 Metric); Size / Dimension: 0.063" L x 0.031" W (1.60mm x 0.80mm); Height: 0.022" (0.55mm); Number of Terminations: 2; Packaging: Cut Tape (CT); ComponentLink1URL: http://industrial.panasonic.com/www-cgi/jvcr13pz.cgi?E+PZ+3+AOA0001+ERJ3GEYJ100V+7+WW; ComponentLink1Description: http://industrial.panasonic.com/www-cgi/jvcr13pz.cgi?E+PZ+3+AOA0001+ERJ3GEYJ100V+7+WW; Supplier Part Number 1: P10GCT-ND
R201-R203 R205 R213-R218 R241-R248 = ERJ-3GEYJ103V: RES 10K OHM 1/10W 5% 0603 SMD; Manufacturer: Panasonic - ECG; Power (Watts): 0.1W, 1/10W; Temperature Coefficient: ±200ppm/°C; Supplier 1: Digi-Key; Manufacturer Part Number: ERJ-3GEYJ103V; RoHS: RoHS Compliant; Category: Resistors; Stock 1: 13981989; Pricing 1: 1=0.1, 50=0.0092, 100=0.007, 250=0.0052, 500=0.00384, 1000=0.00256 (USD); Composition: Thick Film; Features: -; Tolerance: ±5%; Package / Case: 0603 (1608 Metric); Size / Dimension: 0.063" L x 0.031" W (1.60mm x 0.80mm); Height: 0.022" (0.55mm); Number of Terminations: 2; Packaging: Cut Tape (CT); ComponentLink1URL: http://industrial.panasonic.com/www-cgi/jvcr13pz.cgi?E+PZ+3+AOA0001+ERJ3GEYJ103V+7+WW; ComponentLink1Description: http://industrial.panasonic.com/www-cgi/jvcr13pz.cgi?E+PZ+3+AOA0001+ERJ3GEYJ103V+7+WW; Supplier Part Number 1: P10KGCT-ND
  R201-R203: Resistance (Ohms): 10K
R204 R206 R225-R232 = ERJ-3GEY0R00V: RES 0.0 OHM 1/10W 0603 SMD; Manufacturer: Panasonic - ECG; Power (Watts): 0.1W, 1/10W; Tolerance: Jumper; Supplier 1: Digi-Key; Manufacturer Part Number: ERJ-3GEY0R00V; RoHS: RoHS Compliant; Category: Resistors; Pricing 1: 1=0.02, 50=0.0092, 100=0.007, 250=0.0052, 500=0.00384, 1000=0.00256 (USD); Composition: Thick Film; Features: -; Temperature Coefficient: -; Package / Case: 0603 (1608 Metric); Size / Dimension: 0.063" L x 0.031" W (1.60mm x 0.80mm); Height: 0.022" (0.55mm); Number of Terminations: 2; Packaging: Cut Tape (CT); ComponentLink1URL: http://industrial.panasonic.com/www-cgi/jvcr13pz.cgi?E+PZ+3+AOA0001+ERJ3GEY0R00V+7+WW; ComponentLink1Description: http://industrial.panasonic.com/www-cgi/jvcr13pz.cgi?E+PZ+3+AOA0001+ERJ3GEY0R00V+7+WW; Supplier Part Number 1: P0.0GCT-ND
  R204 R206: Stock 1: 12033013
  R225-R232: Stock 1: 12285904
R207-R212 R219 R233-R240 = ERJ-3GEYJ101V: RES 100 OHM 1/10W 5% 0603 SMD; Manufacturer: Panasonic - ECG; Power (Watts): 0.1W, 1/10W; Temperature Coefficient: ±200ppm/°C; Supplier 1: Digi-Key; Manufacturer Part Number: ERJ-3GEYJ101V; RoHS: RoHS Compliant; Category: Resistors; Stock 1: 5128730; Pricing 1: 1=0.1, 50=0.0092, 100=0.007, 250=0.0052, 500=0.00384, 1000=0.00256 (USD); Composition: Thick Film; Features: -; Tolerance: ±5%; Package / Case: 0603 (1608 Metric); Size / Dimension: 0.063" L x 0.031" W (1.60mm x 0.80mm); Height: 0.022" (0.55mm); Number of Terminations: 2; Packaging: Cut Tape (CT); ComponentLink1URL: http://industrial.panasonic.com/www-cgi/jvcr13pz.cgi?E+PZ+3+AOA0001+ERJ3GEYJ101V+7+WW; ComponentLink1Description: http://industrial.panasonic.com/www-cgi/jvcr13pz.cgi?E+PZ+3+AOA0001+ERJ3GEYJ101V+7+WW; Supplier Part Number 1: P100GCT-ND
R220-R224 = CHF1206CNT500LW: RES 50 OHM 20W 5% 1206 SMD; Manufacturer: Bourns Inc.; Supplier 1: Digi-Key; Manufacturer Part Number: CHF1206CNT500LW; RoHS: RoHS Compliant; Category: Resistors; Stock 1: 826; Pricing 1: 1=5.59, 10=3.749, 50=3.381, 100=3.234, 250=2.94, 500=2.646, 1000=2.352, 5000=2.058, 10000=1.9551 (USD); Power (Watts): 20W; Composition: Thick Film; Features: -; Temperature Coefficient: -; Tolerance: ±5%; Package / Case: 1206 (3216 Metric); Size / Dimension: 0.120" L x 0.062" W (3.05mm x 1.57mm); Height: 0.025" (0.64mm); Number of Terminations: 2; Packaging: Bulk; ComponentLink1URL: http://www.bourns.com/data/global/PDFs/CHF1206CNT.pdf; ComponentLink1Description: http://www.bourns.com/data/global/PDFs/CHF1206CNT.pdf; Supplier Part Number 1: CHF1206CNT500LW-ND